# Altium schematic sheet Power-Tree.SchDoc
size A3; SheetNumber: 2; SheetTotal: 32
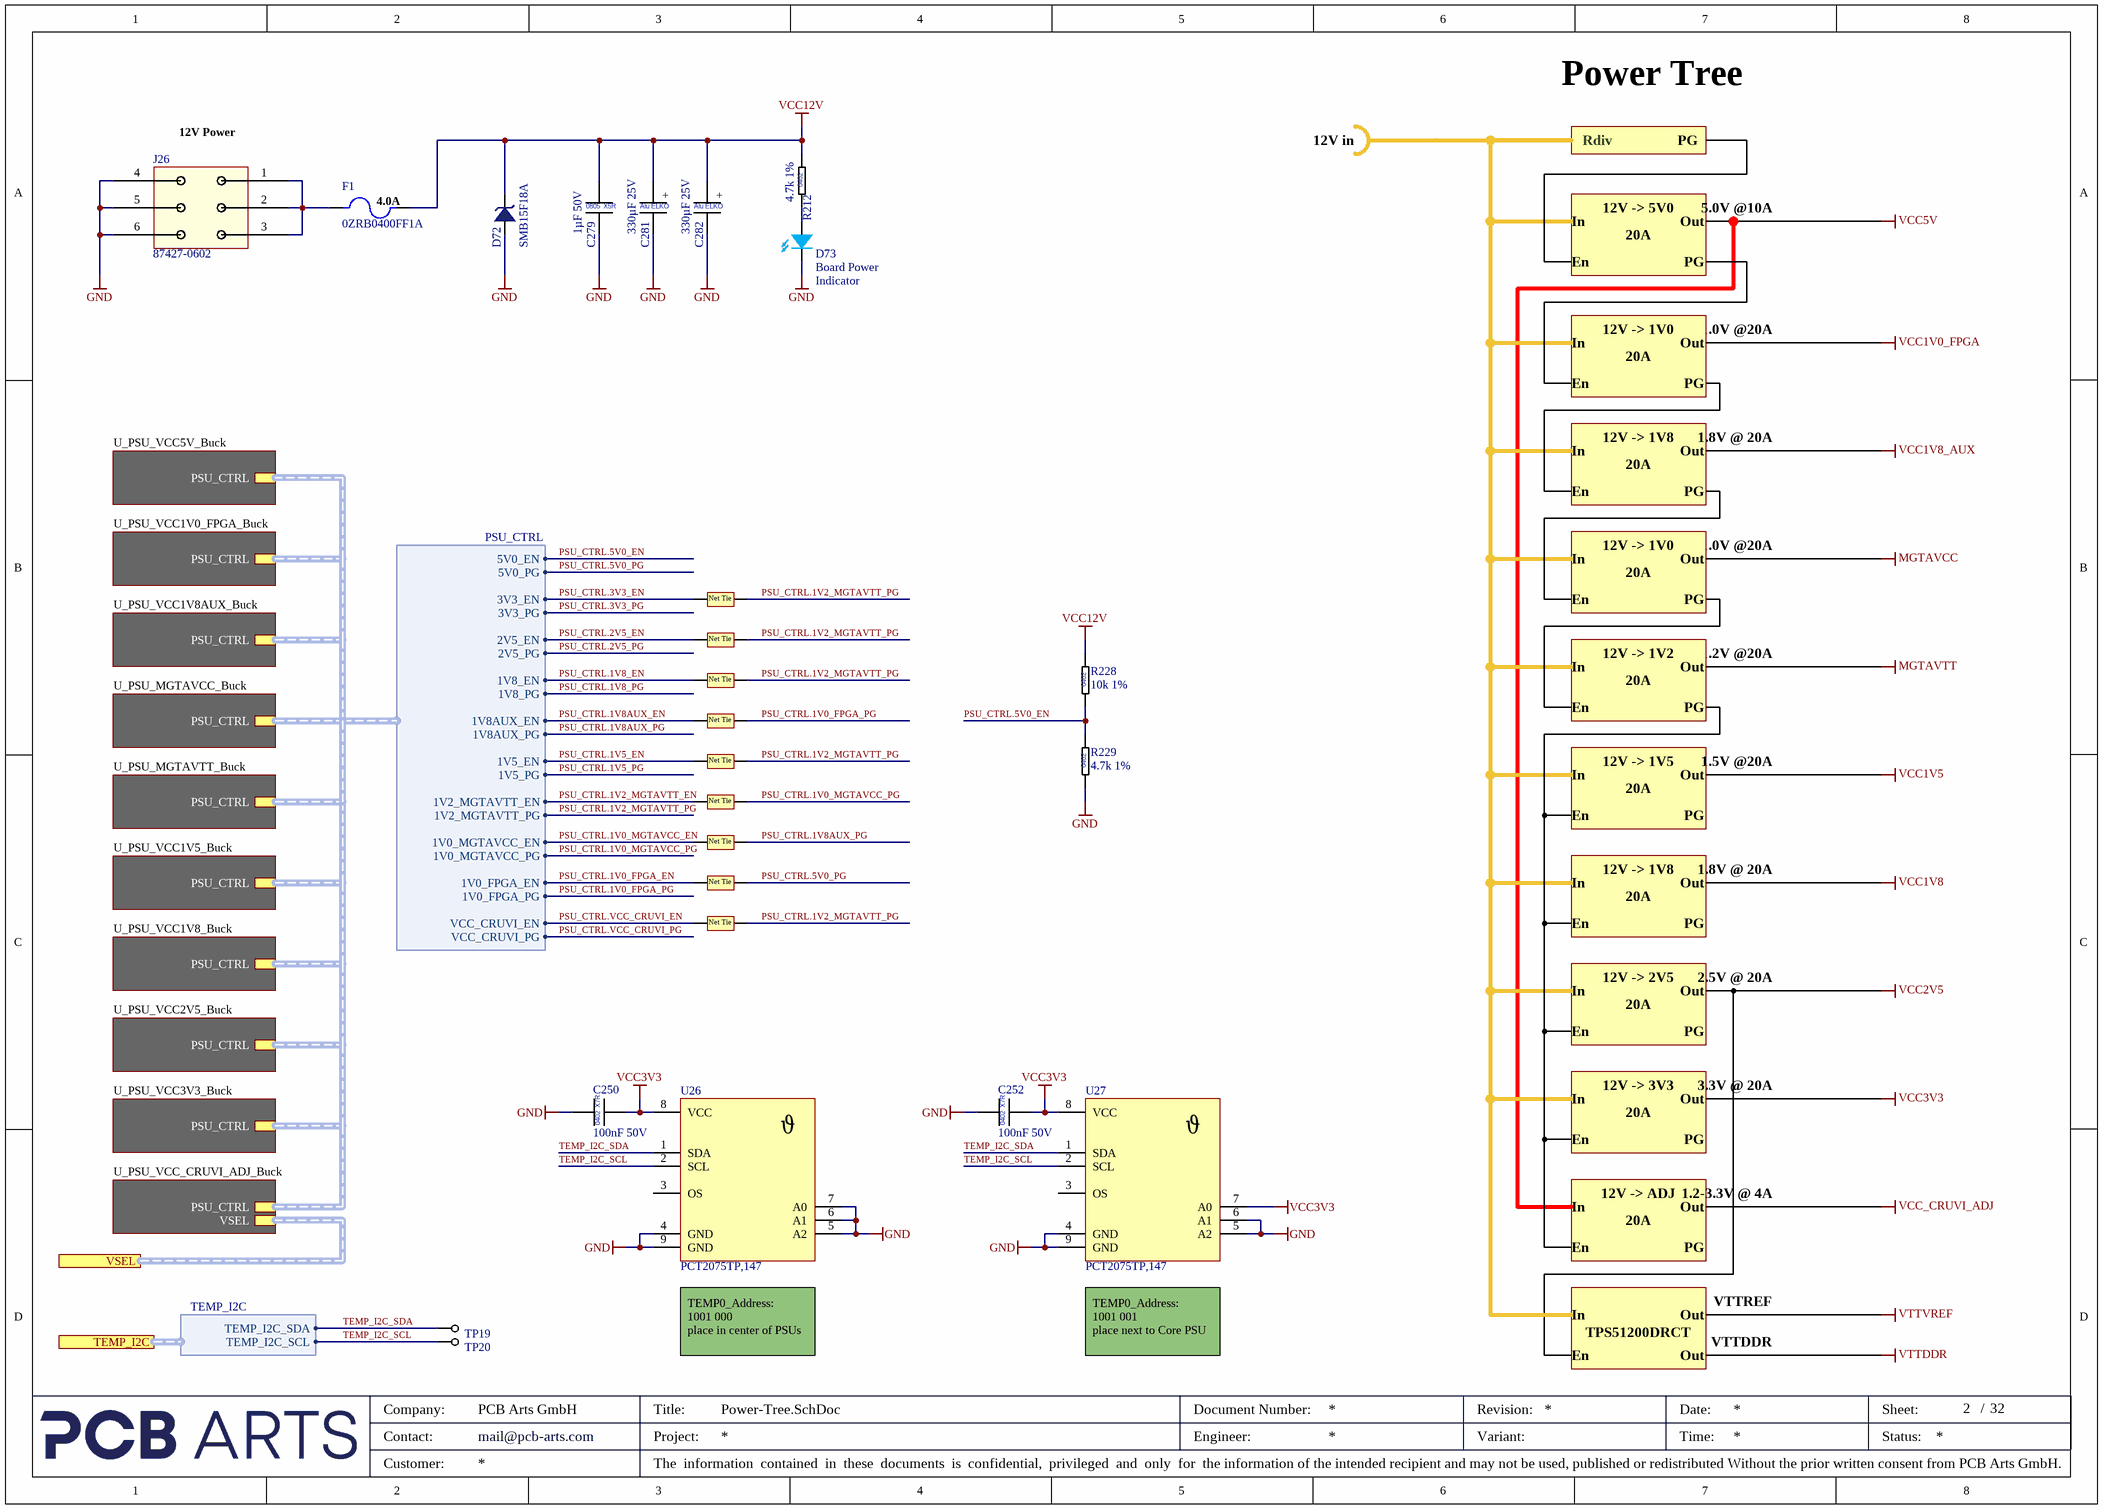
[diagram p0: Power-Tree.SchDoc]

## Parts
C250  100nF 50V  [CAP_0402_L]
C252  100nF 50V  [CAP_0402_L]
C279  1µF 50V  [CAP_0805]
C281  330µF 25V  [WCAP-PTG5_D10H12.5]
C282  330µF 25V  [WCAP-PTG5_D10H12.5]
D72  SMB15F18A  [DO221-AA]
D73  LTST-S270TBKT  [LED-0603 Sideview]  (value not drawn)
F1  0ZRB0400FF1A  [0ZRB0400FF]
J26  87427-0602  [Molex 87427-0602]
NT1  Net Tie  [Net Tie-0.3]  (value not drawn)  (net tie, no BOM)
NT2  Net Tie  [Net Tie-0.3]  (value not drawn)  (net tie, no BOM)
NT3  Net Tie  [Net Tie-0.3]  (value not drawn)  (net tie, no BOM)
NT4  Net Tie  [Net Tie-0.3]  (value not drawn)  (net tie, no BOM)
NT5  Net Tie  [Net Tie-0.3]  (value not drawn)  (net tie, no BOM)
NT6  Net Tie  [Net Tie-0.3]  (value not drawn)  (net tie, no BOM)
NT7  Net Tie  [Net Tie-0.3]  (value not drawn)  (net tie, no BOM)
NT8  Net Tie  [Net Tie-0.3]  (value not drawn)  (net tie, no BOM)
NT9  Net Tie  [Net Tie-0.3]  (value not drawn)  (net tie, no BOM)
R212  4.7k 1%  [RES_0402_L]
R228  10k 1%  [RES_0402_L]
R229  4.7k 1%  [RES_0402_L]
TP19  Testpoint  [Testpoint 0.8mm]  (value not drawn)  (no BOM)
TP20  Testpoint  [Testpoint 0.8mm]  (value not drawn)  (no BOM)
U26  PCT2075TP,147  [SOT1069-2 (HWSON8)]
U27  PCT2075TP,147  [SOT1069-2 (HWSON8)]

## Sub-sheets
U_PSU_MGTAVCC_Buck = PSU_MGTAVCC_Buck.SchDoc: PSU_CTRL (harness PSU_CTRL)
U_PSU_MGTAVTT_Buck = PSU_MGTAVTT_Buck.SchDoc: PSU_CTRL (harness PSU_CTRL)
U_PSU_VCC1V0_FPGA_Buck = PSU_VCC1V0_FPGA_Buck.SchDoc: PSU_CTRL (harness PSU_CTRL)
U_PSU_VCC1V5_Buck = PSU_VCC1V5_Buck.SchDoc: PSU_CTRL (harness PSU_CTRL)
U_PSU_VCC1V8_Buck = PSU_VCC1V8_Buck.SchDoc: PSU_CTRL (harness PSU_CTRL)
U_PSU_VCC1V8AUX_Buck = PSU_VCC1V8AUX_Buck.SchDoc: PSU_CTRL (harness PSU_CTRL)
U_PSU_VCC2V5_Buck = PSU_VCC2V5_Buck.SchDoc: PSU_CTRL (harness PSU_CTRL)
U_PSU_VCC3V3_Buck = PSU_VCC3V3_Buck.SchDoc: PSU_CTRL (harness PSU_CTRL)
U_PSU_VCC5V_Buck = PSU_VCC5V_Buck.SchDoc: PSU_CTRL (harness PSU_CTRL)
U_PSU_VCC_CRUVI_ADJ_Buck = PSU_VCC_CRUVI_ADJ_Buck.SchDoc: PSU_CTRL (harness PSU_CTRL), VSEL (harness VSEL)

## Ports
TEMP_I2C (harness TEMP_I2C, see Top-Level-Sheet[6D], SMI Bank 12[1C]), VSEL (harness VSEL, see Top-Level-Sheet[6C], Bank 13_Bank 15_Bank 16[8D], PSU_VCC_CRUVI_ADJ_Buck[1C])

## Harnesses
TEMP_I2C: TEMP_I2C_SCL, TEMP_I2C_SDA
PSU_CTRL: 5V0_EN, 5V0_PG, 3V3_EN, 3V3_PG, 2V5_EN, 2V5_PG, 1V8_EN, 1V8_PG, 1V8AUX_EN, 1V8AUX_PG, 1V5_EN, 1V5_PG, 1V2_MGTAVTT_EN, 1V2_MGTAVTT_PG, 1V0_MGTAVCC_EN, 1V0_MGTAVCC_PG, 1V0_FPGA_EN, 1V0_FPGA_PG, VCC_CRUVI_EN, VCC_CRUVI_PG

## Nets
GND: C250.1 C252.1 C279.2 C281.2 C282.2 D72.2 D73.1 J26.4 J26.5 J26.6 R229.1 U26.4(GND) U26.5(A2) U26.6(A1) U26.7(A0) U26.9(GND) U27.4(GND) U27.5(A2) U27.6(A1) U27.9(GND)
VCC3V3: C250.2 C252.2 U26.8(VCC) U27.7(A0) U27.8(VCC)
VCC12V: C279.1 C281.1 C282.1 D72.1 F1.2 R212.2 R228.2
PSU_CTRL.1V0_FPGA_EN: NT8.1 ; sheet U_PSU_MGTAVCC_Buck/PSU_CTRL.1V0_FPGA_EN
PSU_CTRL.1V0_FPGA_PG: NT4.2 ; sheet U_PSU_MGTAVCC_Buck/PSU_CTRL.1V0_FPGA_PG
PSU_CTRL.1V0_MGTAVCC_EN: NT7.1 ; sheet U_PSU_MGTAVCC_Buck/PSU_CTRL.1V0_MGTAVCC_EN
PSU_CTRL.1V0_MGTAVCC_PG: NT6.2 ; sheet U_PSU_MGTAVCC_Buck/PSU_CTRL.1V0_MGTAVCC_PG
PSU_CTRL.1V2_MGTAVTT_EN: NT6.1 ; sheet U_PSU_MGTAVCC_Buck/PSU_CTRL.1V2_MGTAVTT_EN
PSU_CTRL.1V2_MGTAVTT_PG: NT1.2 NT2.2 NT3.2 NT5.2 NT9.2 ; sheet U_PSU_MGTAVCC_Buck/PSU_CTRL.1V2_MGTAVTT_PG
PSU_CTRL.1V5_EN: NT5.1 ; sheet U_PSU_MGTAVCC_Buck/PSU_CTRL.1V5_EN
PSU_CTRL.1V5_PG: sheet U_PSU_MGTAVCC_Buck/PSU_CTRL.1V5_PG
PSU_CTRL.1V8_EN: NT3.1 ; sheet U_PSU_MGTAVCC_Buck/PSU_CTRL.1V8_EN
PSU_CTRL.1V8_PG: sheet U_PSU_MGTAVCC_Buck/PSU_CTRL.1V8_PG
PSU_CTRL.1V8AUX_EN: NT4.1 ; sheet U_PSU_MGTAVCC_Buck/PSU_CTRL.1V8AUX_EN
PSU_CTRL.1V8AUX_PG: NT7.2 ; sheet U_PSU_MGTAVCC_Buck/PSU_CTRL.1V8AUX_PG
PSU_CTRL.2V5_EN: NT2.1 ; sheet U_PSU_MGTAVCC_Buck/PSU_CTRL.2V5_EN
PSU_CTRL.2V5_PG: sheet U_PSU_MGTAVCC_Buck/PSU_CTRL.2V5_PG
PSU_CTRL.3V3_EN: NT1.1 ; sheet U_PSU_MGTAVCC_Buck/PSU_CTRL.3V3_EN
PSU_CTRL.3V3_PG: sheet U_PSU_MGTAVCC_Buck/PSU_CTRL.3V3_PG
PSU_CTRL.5V0_EN: R228.1 R229.2 ; sheet U_PSU_MGTAVCC_Buck/PSU_CTRL.5V0_EN
PSU_CTRL.5V0_PG: NT8.2 ; sheet U_PSU_MGTAVCC_Buck/PSU_CTRL.5V0_PG
PSU_CTRL.VCC_CRUVI_EN: NT9.1 ; sheet U_PSU_MGTAVCC_Buck/PSU_CTRL.VCC_CRUVI_EN
PSU_CTRL.VCC_CRUVI_PG: sheet U_PSU_MGTAVCC_Buck/PSU_CTRL.VCC_CRUVI_PG
TEMP_I2C_SCL: TP20.1(GND) U26.2(SCL) U27.2(SCL) ; port TEMP_I2C.TEMP_I2C_SCL
TEMP_I2C_SDA: TP19.1(GND) U26.1(SDA) U27.1(SDA) ; port TEMP_I2C.TEMP_I2C_SDA
NetD73_2: D73.2 R212.1
NetF1_1: F1.1 J26.1 J26.2 J26.3

Not connected (* = marked no-connect by the designer): U26 3(OS); U27 3(OS)

## Buses and harness runs
harness port VSEL = sheet U_PSU_VCC_CRUVI_ADJ_Buck/VSEL
harness sheet U_PSU_MGTAVCC_Buck/PSU_CTRL = sheet U_PSU_MGTAVTT_Buck/PSU_CTRL = sheet U_PSU_VCC1V0_FPGA_Buck/PSU_CTRL = sheet U_PSU_VCC1V5_Buck/PSU_CTRL = sheet U_PSU_VCC1V8_Buck/PSU_CTRL = sheet U_PSU_VCC1V8AUX_Buck/PSU_CTRL = sheet U_PSU_VCC2V5_Buck/PSU_CTRL = sheet U_PSU_VCC3V3_Buck/PSU_CTRL = sheet U_PSU_VCC5V_Buck/PSU_CTRL = sheet U_PSU_VCC_CRUVI_ADJ_Buck/PSU_CTRL

## Notes on the sheet
- Power Tree
- (near J26) 12V Power
- 12V in
- Rdiv
- PG
- In
- 12V -> 5V0
- 20A
- Out
- 5.0V @10A
- VCC5V
- (near D73) Board Power
- (near D73) Indicator
- En
- 12V -> 1V0
- 1.0V @20A
- VCC1V0_FPGA
- 12V -> 1V8
- 1.8V @ 20A
- VCC1V8_AUX
- MGTAVCC
- 12V -> 1V2
- 1.2V @20A
- MGTAVTT
- 12V -> 1V5
- 1.5V @20A
- VCC1V5
- VCC1V8
- 12V -> 2V5
- 2.5V @ 20A
- VCC2V5
- 12V -> 3V3
- 3.3V @ 20A
- VCC3V3
- 12V -> ADJ
- 1.2-3.3V @ 4A
- VCC_CRUVI_ADJ
- VTTREF
- VTTVREF
- (near U26) TEMP0_Address:
  1001 000
  place in center of PSUs
- (near U27) TEMP0_Address:
  1001 001
  place next to Core PSU
- TPS51200DRCT
- VTTDDR
- Company:
- Contact:
- Customer:
- mail@pcb-arts.com
- PCB Arts GmbH
- Title:
- Project:
- The  information  contained  in  these  documents  is  confidential,  privileged  and  only  for  the information of the intended recipient and may not be used, published or redistributed Without the prior written consent from PCB Arts GmbH.
- Engineer:
- Document Number:
- Revision:
- Variant:
- Date:
- Time:
- Sheet:
- Status:
- /
- (in symbol 0ZRB0400FF1A_Rückstellbare Sicherung 4.0A, 30V) 4.0A
- (in symbol CAP_0402_100nF_50V) X7R; 0402
- (in symbol CAP_0805_1µF_50V) 0805; X5R
- (in symbol CAP_D10L12.5_330µF_25V) +; Alu ELKO
- (in symbol PCT2075TP,147_Digital Temp Sensor I2C) ϑ
- (in symbol RES_0402_4.7k_1%) 0402
- (in symbol RES_0402_10k_1%) 0402

## Library data of the parts
C250 C252 = CAP_0402_100nF_50V: Multilayer Ceramic Capacitors MLCC - SMD/SMT 0402 50VDC; Manufacturer 1: Murata Electronics; Manufacturer 1 Prt. Nr.: GCM155L8EH104KE07D; Manufacturer 2 Prt. Nr.: UMK105B7104KV-FR; Manufacturer 2: TDK
C279 = CAP_0805_1µF_50V: Multilayer Ceramic Capacitors MLCC - SMD/SMT 0805 50VDC; Manufacturer 1: Samsung Electro-Mechanics; Manufacturer 1 Prt. Nr.: CL21B105KBFNNNG; Manufacturer 2 Prt. Nr.: UMK212BJ105KGHT; Manufacturer 2: Taiyo Yuden
C281 C282 = CAP_D10L12.5_330µF_25V: Organische Polymer-Aluminiumkondensatoren 330uF 25 Volts 20% AEC-Q200; Manufacturer 1: Würth Elektronik; Manufacturer 1 Prt. Nr.: 870025575009
D72 = SMB15F18A_ESD-Entstörer/TVS-Dioden 1500 W, 18 V TVS: ESD-Entstörer/TVS-Dioden 1500 W, 18 V TVS; Manufacturer 1: STMicroelectronics; Manufacturer 1 Prt. Nr.: SMB15F18A
D73 = LED 0603 Blue Sideview: BLUE  0603 Light Emitting Diode; Manufacturer 1: lite-On; Manufacturer 1 Prt. Nr.: LTST-S270TBKT; Color: Blue
F1 = 0ZRB0400FF1A_Rückstellbare Sicherung 4.0A, 30V: Rückstellbare Sicherung 4.0A, 30V; Manufacturer 1: Bel Fuse; Manufacturer 1 Prt. Nr.: 0ZRB0400FF1A
J26 = 87427-0602_Mini-Fit Jr. Right angle Header, 4.20mm Pitch, Dual Row, 6 Circuits: Mini-Fit Jr. Right angle Header, 4.20mm Pitch, Dual Row, 6 Circuits; Manufacturer 1: MOLEX; Manufacturer 1 Prt. Nr.: 874270602
R212 R229 = RES_0402_4.7k_1%: Thick Film Resistors - SMD 4.7kOhm 1%; Manufacturer 1: Vishay / Dale; Manufacturer 1 Prt. Nr.: CRCW04024K70FKEDC; Manufacturer 2 Prt. Nr.: RC0402FR-134K7L; Manufacturer 2: Yageo
R228 = RES_0402_10k_1%: Thick Film Resistors - SMD 10kOhm 1%; Manufacturer 1: Vishay / Dale; Manufacturer 1 Prt. Nr.: CRCW040210K0FKEDC; Manufacturer 2 Prt. Nr.: RC0402FR-7W10KL; Manufacturer 2: Yageo
TP19 TP20 = Testpoint 0.8mm
U26 U27 = PCT2075TP,147_Digital Temp Sensor I2C: Digital Temp Sensor I2C; Manufacturer 1: NXP; Manufacturer 1 Prt. Nr.: PCT2075TP,147